# Altium schematic sheet Mircocontroller.SchDoc
size A; SheetNumber: 3; SheetTotal: 3
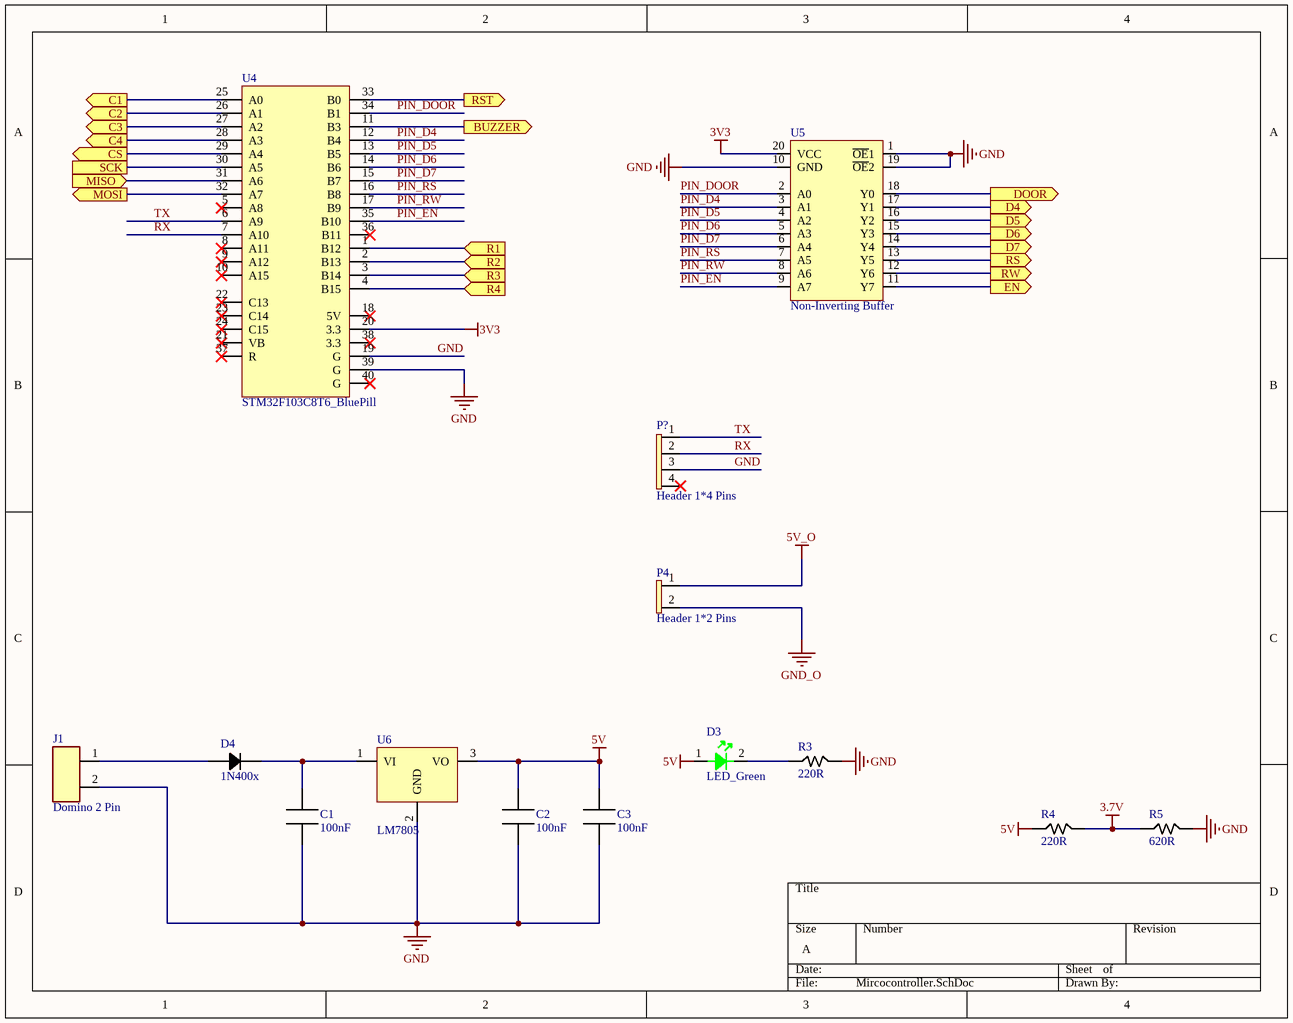
[diagram p0: Mircocontroller.SchDoc]

## Parts
C1  100nF  [CAPC0805]
C2  100nF  [CAPC0805]
C3  100nF  [CAPC0805]
D3  LED_Green  [LED SMD 0805]
D4  1N400x  [1N4007-M7]
J1  Domino 2 Pin  [domino_2_pin]
P4  Header 1*2 Pins  [HDR_M_2_PINS_2.54]
P?  Header 1*4 Pins  [HDR_M_4_PINS_2.54]
R3  220R  [RESC0805]
R4  220R  [RESC0805]
R5  620R  [RESC0805]
U4  STM32F103C8T6_BluePill  [STM32F103C8T6_BluePill]
U5  Non-Inverting Buffer  [DIP_20]
U6  LM7805  [TO-252]

## Ports
BUZZER (out), C1 (out), C2 (out), C3 (out), C4 (out), CS (out), D4 (out), D5 (out), D6 (out), D7 (out), DOOR (out), EN (out), MISO (in), MOSI (out), R1 (in), R2 (in), R3 (in), R4 (in), RS (out), RST (out), RW (out), SCK

## Nets
3.7V: R4.2 R5.1
3V3: U4.20(3.3) U5.20(VCC)
5V: C2.2 C3.2 D3.1 R4.1 U6.3(VO)
5V_O: P4.1
GND: C1.1 C2.1 C3.1 J1.2 P?.3 R3.2 R5.2 U4.19(G) U4.39(G) U5.1(~{OE}1) U5.10(GND) U5.19(~{OE}2) U6.2(GND)
GND_O: P4.2
BUZZER: U4.11(B3) ; port BUZZER
C1: U4.25(A0) ; port C1
C2: U4.26(A1) ; port C2
C3: U4.27(A2) ; port C3
C4: U4.28(A3) ; port C4
CS: U4.29(A4) ; port CS
D4: U5.17(Y1) ; port D4
D5: U5.16(Y2) ; port D5
D6: U5.15(Y3) ; port D6
D7: U5.14(Y4) ; port D7
DOOR: U5.18(Y0) ; port DOOR
EN: U5.11(Y7) ; port EN
MISO: U4.31(A6) ; port MISO
MOSI: U4.32(A7) ; port MOSI
PIN_D4: U4.12(B4) U5.3(A1)
PIN_D5: U4.13(B5) U5.4(A2)
PIN_D6: U4.14(B6) U5.5(A3)
PIN_D7: U4.15(B7) U5.6(A4)
PIN_DOOR: U4.34(B1) U5.2(A0)
PIN_EN: U4.35(B10) U5.9(A7)
PIN_RS: U4.16(B8) U5.7(A5)
PIN_RW: U4.17(B9) U5.8(A6)
R1: U4.1(B12) ; port R1
R2: U4.2(B13) ; port R2
R3: U4.3(B14) ; port R3
R4: U4.4(B15) ; port R4
RS: U5.13(Y5) ; port RS
RST: U4.33(B0) ; port RST
RW: U5.12(Y6) ; port RW
RX: P?.2 U4.7(A10)
SCK: U4.30(A5) ; port SCK
TX: P?.1 U4.6(A9)
NetC1_2: C1.2 D4.2 U6.1(VI)
NetD3_2: D3.2 R3.1
NetD4_1: D4.1 J1.1

Not connected (* = marked no-connect by the designer): P? 4*; U4 5(A8)* 8(A11)* 9(A12)* 10(A15)* 18(5V)* 21(VB)* 22(C13)* 23(C14)* 24(C15)* 36(B11)* 37(R)* 38(3.3)* 40(G)*

## Library data of the parts
C1-C3 = Capacitor Non Polar: Capacitor_Non_Polar
D4 = Diode 1N4007: 1A - 1kV
J1 = Domino 2 Pin: 2 Pins, 5.08mm
P4 = Header 1x2 Pins
P? = Header 1x4 Pins
R3-R5 = Resistor: Resistor_TH_1/4W
U4 = STM32F103C8T6_BluePill: STM32F103C8T6 BluePill
U5 = 74HC541
U6 = LM7805: 5V, 1A